# EAGLE schematic untitled (EAGLE 6.5.0)
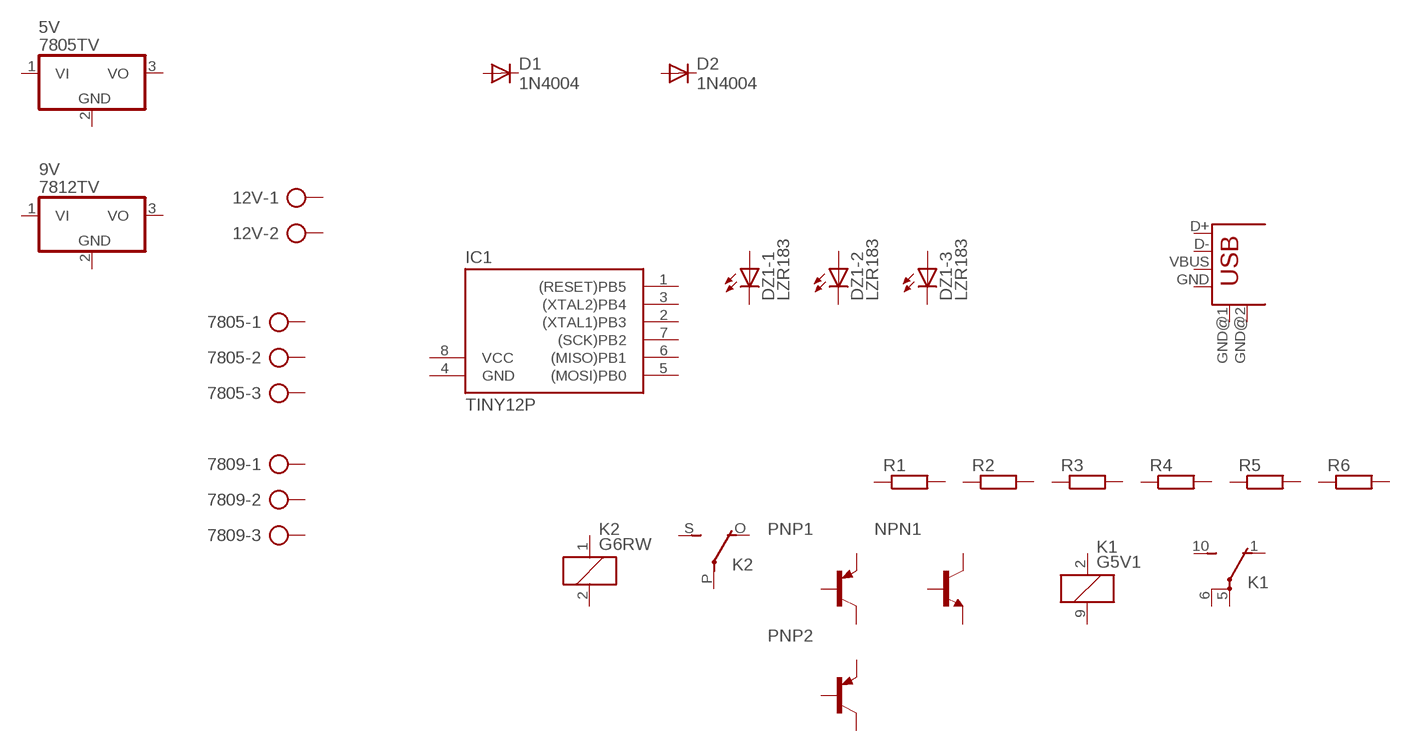
[diagram p0: schematic, sheet 1]

## Parts
5V  7805TV  [TO220V]
9V  7812TV  [TO220V]
12V  AK500/2  [AK500/2]
7805  AK500/3  [AK500/3]
7809  AK500/3  [AK500/3]
D1  1N4004  [DO41-10]
D2  1N4004  [DO41-10]
DZ1  LZR183  [LZR183]
IC1  TINY12P  [DIL08]
K1  G5V1  [G5V1]
K2  G6RW  [G6RW]
NPN1  -NPN-TO92-ECB  [TO92-ECB]
PNP1  2N4126-PNP-TO92-CBE  [TO92-CBE]
PNP2  2N4126-PNP-TO92-CBE  [TO92-CBE]
R1  R-EU_0204/7  [0204/7]
R2  R-EU_0204/7  [0204/7]
R3  R-EU_0204/7  [0204/7]
R4  R-EU_0204/7  [0204/7]
R5  R-EU_0204/7  [0204/7]
R6  R-EU_0204/7  [0204/7]
USB1  USB-A-H  [USB-A-H]
Unconnected: 5V.1(VI) 5V.2(GND) 5V.3(VO) 9V.1(VI) 9V.2(GND) 9V.3(VO) 12V.1 12V.2 7805.1 7805.2 7805.3 7809.1 7809.2 7809.3 D1.A D1.C D2.A D2.C DZ1.A1(-1:A) DZ1.A2(-2:A) DZ1.A3(-3:A) DZ1.K1(-1:C) DZ1.K2(-2:C) DZ1.K3(-3:C) IC1.1((RESET)PB5) IC1.2((XTAL1)PB3) IC1.3((XTAL2)PB4) IC1.5((MOSI)PB0) IC1.6((MISO)PB1) IC1.7((SCK)PB2) K1.1(2:O) K1.2 K1.5(2:P) K1.6(2:P) K1.9 K1.10(2:S) K2.1 K2.2 K2.O(2:O) K2.P(2:P) K2.S(2:S) NPN1.B NPN1.C NPN1.E PNP1.B PNP1.C PNP1.E PNP2.B PNP2.C PNP2.E R1.1 R1.2 R2.1 R2.2 R3.1 R3.2 R4.1 R4.2 R5.1 R5.2 R6.1 R6.2 USB1.D+ USB1.D- USB1.GND USB1.GND@1(GND) USB1.GND@2(GND) USB1.VBUS

## Power pins joined to a net without a drawn wire
GND: IC1.4(GND)
VCC: IC1.8(VCC)

## Library data of the parts
5V 9V = linear:78*: Positive VOLTAGE REGULATOR Source: http://cache.national.com/ds/LM/LM78L05.pdf http://www.fairchildsemi.com/ds/LM/LM7805.pdf
12V = con-ptr500:AK500/2: CONNECTOR; OC_FARNELL: unknown; OC_NEWARK: unknown
7805 7809 = con-ptr500:AK500/3: CONNECTOR; OC_FARNELL: unknown; OC_NEWARK: unknown
D1 D2 = diode:1N4004: DIODE general purpose rectifier, 1 A
DZ1 = led:LZR183: LED BLOCK 3 LEDs, Siemens
IC1 = atmel:TINY12*: MICROCONTROLLER 1 Kbytes FLASH 64 bytes EEPROM; OC_FARNELL: unknown; OC_NEWARK: unknown
K1 = relay2:G5V1: RELAY 1 x switch, 0.5 A/125 V AC, 1 A/24 V DC , Omron
K2 = relay:G6RW: RELAY 1 x switch, Omron; OC_FARNELL: unknown; OC_NEWARK: unknown
NPN1 = transistor:*-NPN-: NPN Transistror BF959 corrected 2008.03.06
PNP1 PNP2 = transistor:*-PNP-: PNP Transistror
R1-R6 = resistor:R-EU_: RESISTOR, European symbol
USB1 = con-usb-2:USB: USB Connectors